# Altium project Project D.PrjPcb
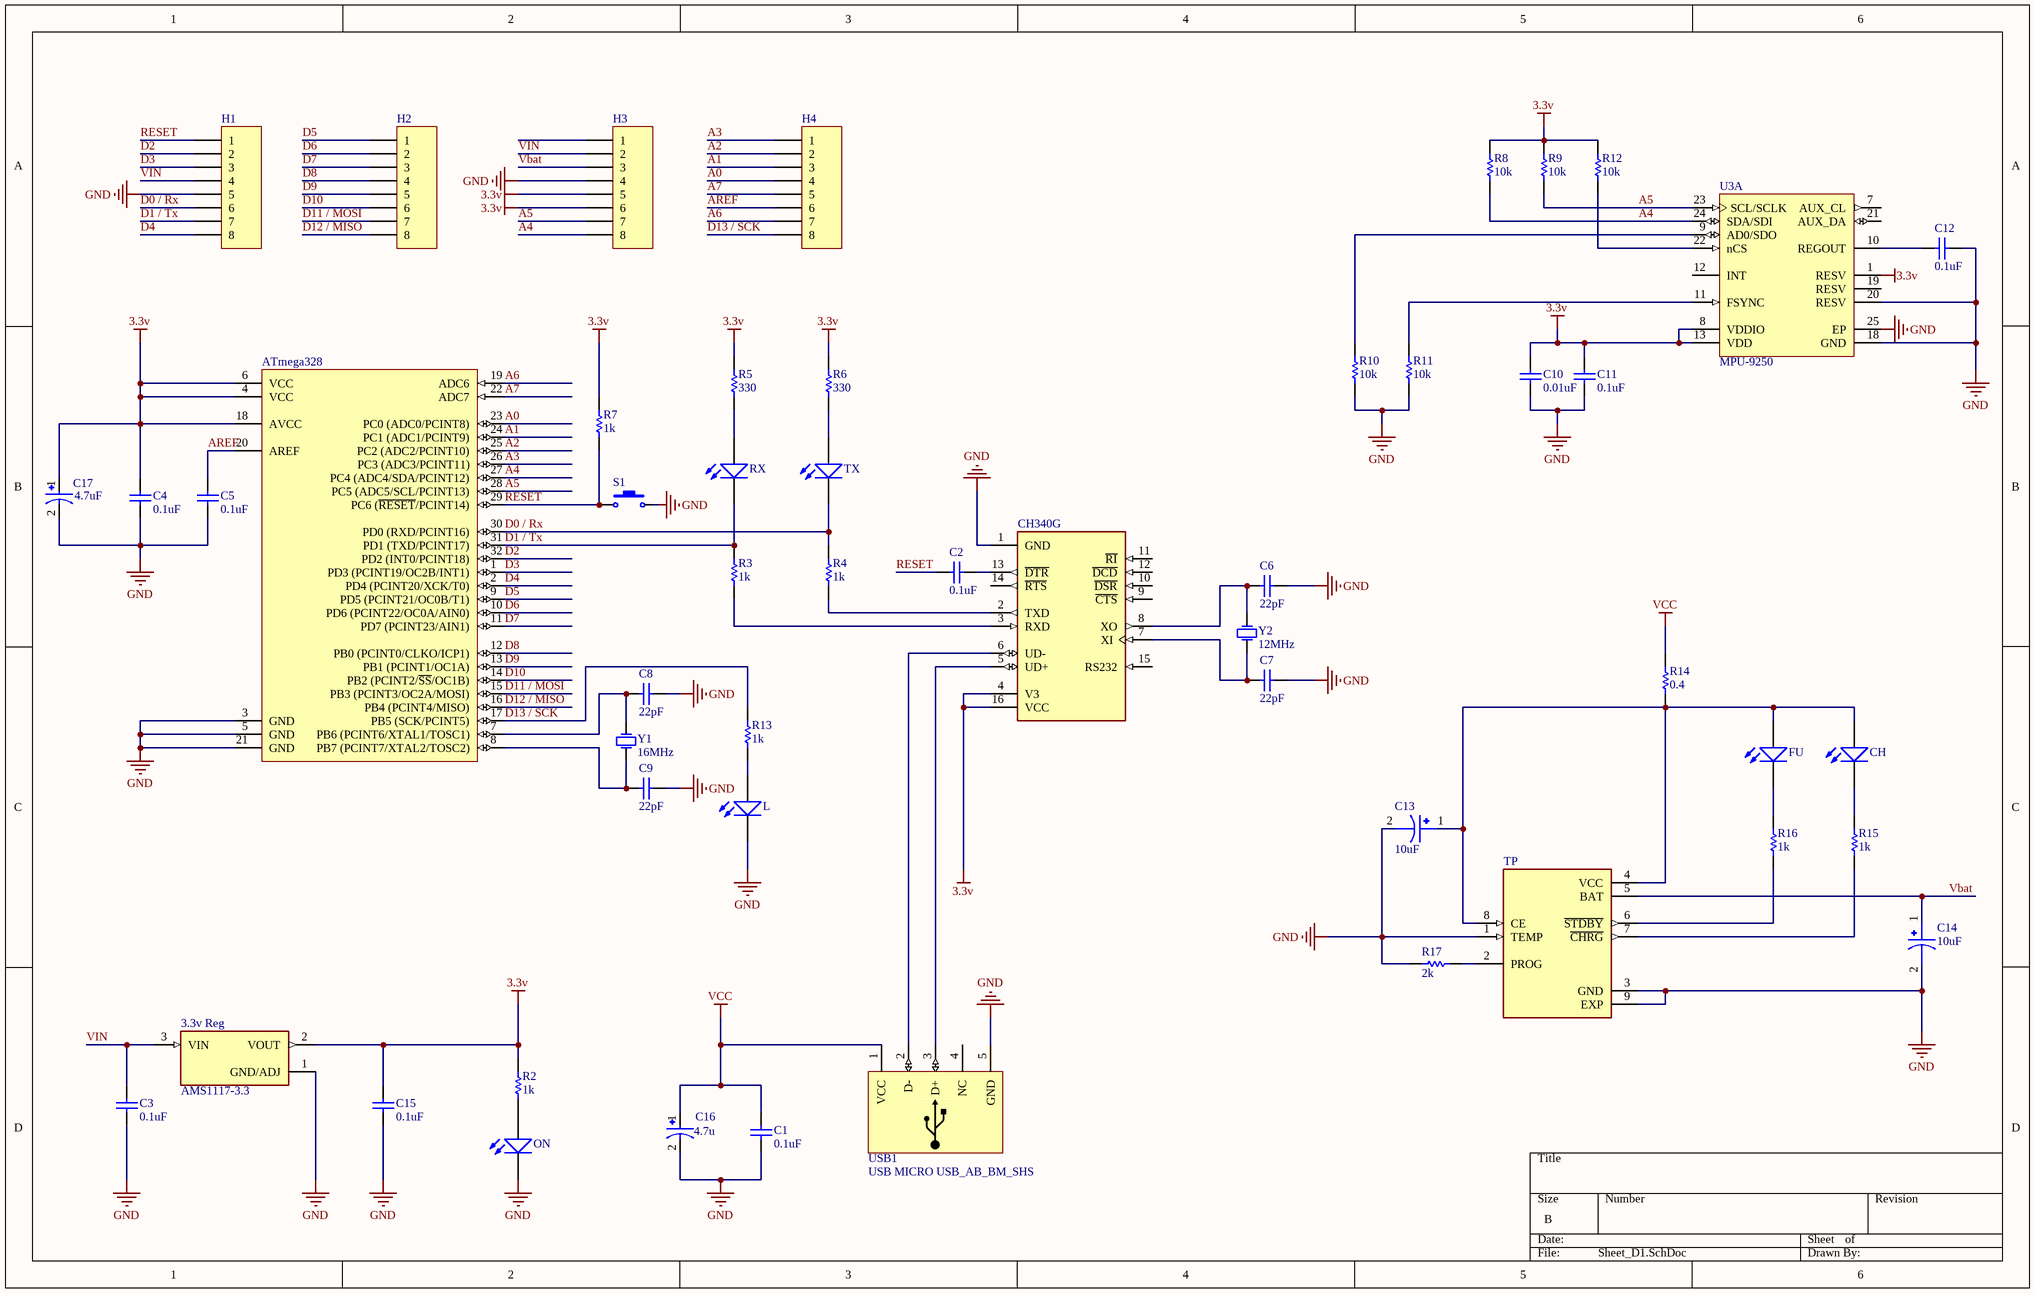
[diagram p0: Sheet_D1.SchDoc]
1 sheet, 52 parts. Net scope: global (net labels, ports and power ports of the same name join across sheets).
Board file: PCB_D1.PcbDoc

## Sheet Sheet_D1.SchDoc
size B; SheetNumber: 1; SheetTotal: 1

### Parts
3.3v_Reg  AMS1117-3.3  [SOT229P700X180-4N]
ATmega328  (no value)  [32A_L]
C1  0.1uF  [CAP0805]
C2  0.1uF  [CAP0805]
C3  0.1uF  [CAP0805]
C4  0.1uF  [CAP0805]
C5  0.1uF  [CAP0805]
C6  22pF  [CAP0805]
C7  22pF  [CAP0805]
C8  22pF  [CAP0805]
C9  22pF  [CAP0805]
C10  0.01uF  [CAP0805]
C11  0.1uF  [CAP0805]
C12  0.1uF  [CAP0805]
C13  10uF  [CAPMP3216X180N]
C14  10uF  [CAPMP3216X180N]
C15  0.1uF  [CAP0805]
C16  4.7u  [CAPMP3516X190N]
C17  4.7uF  [CAPMP3516X190N]
CH  (no value)  [LED_SMD_0805]
CH340G  (no value)  [SOIC127P600X180-16N]
FU  (no value)  [LED_SMD_0805]
H1  (no value)  [Header 8]
H2  (no value)  [Header 8]
H3  (no value)  [Header 8]
H4  (no value)  [Header 8]
L  (no value)  [LED_SMD_0805]
ON  (no value)  [LED_SMD_0805]
R2  1k  [RES0805]
R3  1k  [RES0805]
R4  1k  [RES0805]
R5  330  [RES0805]
R6  330  [RES0805]
R7  1k  [RES0805]
R8  10k  [RES0805]
R9  10k  [RES0805]
R10  10k  [RES0805]
R11  10k  [RES0805]
R12  10k  [RES0805]
R13  1k  [RES0805]
R14  0.4  [RES0805]
R15  1k  [RES0805]
R16  1k  [RES0805]
R17  2k  [RES0805]
RX  (no value)  [LED_SMD_0805]
S1  (no value)  [Push Button Switch SMD]
TP  (no value)  [SOIC127P600X175-9N]
TX  (no value)  [LED_SMD_0805]
U3  MPU-9250  [INSE-QFN-24-1700X1540TP_M]  (part A of 2)
USB1  USB MICRO USB_AB_BM_SHS  [USB MICRO USB_AB_BM_SHS]
Y1  16MHz  [Crystal SMD]
Y2  12MHz  [Crystal SMD]

### Nets
3.3v: 3.3v_Reg.2(VOUT) ATmega328.4(VCC) ATmega328.6(VCC) ATmega328.18(AVCC) C4.1 C10.2 C11.2 C15.2 C17.1 CH340G.4(V3) CH340G.16(VCC) H3.5 H3.6 R2.2 R5.2 R6.2 R7.2 R8.2 R9.2 R12.2 U3.1(RESV) U3.8(VDDIO) U3.13(VDD)
GND: 3.3v_Reg.1(GND/ADJ) ATmega328.3(GND) ATmega328.5(GND) ATmega328.21(GND) C1.1 C3.2 C4.2 C5.1 C6.1 C7.1 C8.1 C9.1 C10.1 C11.1 C12.2 C13.2 C14.2 C15.1 C16.2 C17.2 CH340G.1(GND) H1.5 H3.4 L.1(K) ON.1(K) R10.2 R11.1 R17.1 S1.2 TP.1(TEMP) TP.3(GND) TP.9(EXP) U3.18(GND) U3.20(RESV) U3.25(EP) USB1.5(GND)
VCC: C1.2 C16.1 R14.2 USB1.1(VCC)
A0: ATmega328.23(PC0_(ADC0/PCINT8)) H4.4
A1: ATmega328.24(PC1_(ADC1/PCINT9)) H4.3
A2: ATmega328.25(PC2_(ADC2/PCINT10)) H4.2
A3: ATmega328.26(PC3_(ADC3/PCINT11)) H4.1
A4: ATmega328.27(PC4_(ADC4/SDA/PCINT12)) H3.8 R8.1 U3.24(SDA/SDI)
A5: ATmega328.28(PC5_(ADC5/SCL/PCINT13)) H3.7 R9.1 U3.23(SCL/SCLK)
A6: ATmega328.19(ADC6) H4.7
A7: ATmega328.22(ADC7) H4.5
AREF: ATmega328.20(AREF) C5.2 H4.6
D0 / Rx: ATmega328.30(PD0_(RXD/PCINT16)) H1.6 R4.2 TX.1(K)
D1 / Tx: ATmega328.31(PD1_(TXD/PCINT17)) H1.7 R3.2 RX.1(K)
D2: ATmega328.32(PD2_(INT0/PCINT18)) H1.2
D3: ATmega328.1(PD3_(PCINT19/OC2B/INT1)) H1.3
D4: ATmega328.2(PD4_(PCINT20/XCK/T0)) H1.8
D5: ATmega328.9(PD5_(PCINT21/OC0B/T1)) H2.1
D6: ATmega328.10(PD6_(PCINT22/OC0A/AIN0)) H2.2
D7: ATmega328.11(PD7_(PCINT23/AIN1)) H2.3
D8: ATmega328.12(PB0_(PCINT0/CLKO/ICP1)) H2.4
D9: ATmega328.13(PB1_(PCINT1/OC1A)) H2.5
D10: ATmega328.14(PB2_(PCINT2/~{SS}/OC1B)) H2.6
D11 / MOSI: ATmega328.15(PB3_(PCINT3/OC2A/MOSI)) H2.7
D12 / MISO: ATmega328.16(PB4_(PCINT4/MISO)) H2.8
D13 / SCK: ATmega328.17(PB5_(SCK/PCINT5)) H4.8 R13.1
RESET: ATmega328.29(PC6_(~{RESET}/PCINT14)) C2.2 H1.1 R7.1 S1.1
Vbat: C14.1 H3.3 TP.5(BAT)
VIN: 3.3v_Reg.3(VIN) C3.1 H1.4 H3.2
NetATmega328_7: ATmega328.7(PB6_(PCINT6/XTAL1/TOSC1)) C8.2 Y1.2(OSC2)
NetATmega328_8: ATmega328.8(PB7_(PCINT7/XTAL2/TOSC2)) C9.2 Y1.1(OSC1)
NetC2_1: C2.1 CH340G.13(~{DTR})
NetC6_2: C6.2 CH340G.8(XO) Y2.2(OSC2)
NetC7_2: C7.2 CH340G.7(XI) Y2.1(OSC1)
NetC12_1: C12.1 U3.10(REGOUT)
NetC13_1: C13.1 CH.2(A) FU.2(A) R14.1 TP.4(VCC) TP.8(CE)
NetCH340G_2: CH340G.2(TXD) R4.1
NetCH340G_3: CH340G.3(RXD) R3.1
NetCH340G_5: CH340G.5(UD+) USB1.3(D+)
NetCH340G_6: CH340G.6(UD-) USB1.2(D-)
NetCH_1: CH.1(K) R15.1
NetFU_1: FU.1(K) R16.2
NetL_2: L.2(A) R13.2
NetON_2: ON.2(A) R2.1
NetR5_1: R5.1 RX.2(A)
NetR6_1: R6.1 TX.2(A)
NetR10_1: R10.1 U3.9(AD0/SDO)
NetR11_2: R11.2 U3.11(FSYNC)
NetR12_1: R12.1 U3.22(nCS)
NetR15_2: R15.2 TP.7(~{CHRG})
NetR16_1: R16.1 TP.6(~{STDBY})
NetR17_2: R17.2 TP.2(PROG)

Not connected (* = marked no-connect by the designer): CH340G 9(~{CTS}) 10(~{DSR}) 11(~{RI}) 12(~{DCD}) 14(~{RTS}) 15(RS232); H3 1; U3 7(AUX_CL) 12(INT) 19(RESV) 21(AUX_DA); USB1 4(NC)

### Library data of the parts
3.3v_Reg = AMS1117-3.3: Sot223/Pkg 1-Amp 3.3-Volt Low Drop Out Voltage Regulatator; MF: Advanced Monolithic Systems; Package: SOT-223 Seeed Technology; Value: *; Check_prices: https://www.snapeda.com/parts/AMS1117-3.3/Advanced+Monolithic+Systems/view-part/?ref=eda; Price: None; Availability: Not in stock; MP: AMS1117-3.3; SnapEDA_Link: https://www.snapeda.com/parts/AMS1117-3.3/Advanced+Monolithic+Systems/view-part/?ref=snap
ATmega328 = CMP-0095-00261-2: 8-bit AVR Microcontroller, 32KB Flash, 1KB EEPROM, 2KB SRAM, 32-pin TQFP, Industrial Grade (-40°C to 85°C); DatasheetVersion: revD, May-2011; ComponentLink3Description: ATmega48A/48PA/88A/88PA/168A/168PA/328/328P Summary; Code_JEDEC: MS-026-ABA; ComponentLink1URL: http://www.atmel.com/; RevisionNote: DatasheetVersion & PackageVersion updated. URLs added.; ComponentLink2Description: ATmega48A/48PA/88A/88PA/168A/168PA/328/328P Datasheet; ComponentLink1Description: Manufacturer URL; ComponentLink2URL: http://www.atmel.com/dyn/resources/prod_documents/doc8271.pdf; PackageReference: 32A; ComponentLink3URL: http://www.atmel.com/dyn/resources/prod_documents/8271S.pdf; PackageDescription: 32-Lead, 7x7x1.0 mm Body, 0.8mm Lead Pitch, Thin Profile Plastic Quad Flat Package (TQFP); PackageVersion: revC, Oct-2010
C1-C12 C15 = CAP0805
C13 C14 = TAJA106K016RNJ: MF: AVX; MP: TAJA106K016RNJ; Price: None; Availability: Warning; SnapEDA_Link: https://www.snapeda.com/parts/TAJA106K016RNJ/AVX%20/%20Kyocera/view-part/47127/?ref=snap; Arrow_Electronics-Purchase-URL: https://snapeda.com/shop?store=Arrow+Electronics&id=47127; Value: *; Mouser-Purchase-URL: https://snapeda.com/shop?store=Mouser&id=47127; Package: 1206 AVX
C16 C17 = TAJB475K025RNJ: 4.7 ÂµF Molded Tantalum Capacitors 25 V 1411 (3528 Metric), 1210 1.5Ohm; MF: AVX; Package: 1411 AVX Corporation; Availability: In Stock; Value: *; MP: TAJB475K025RNJ; Purchase-URL: https://pricing.snapeda.com/search/part/TAJB475K025RNJ/?ref=eda; Check_prices: https://www.snapeda.com/parts/TAJB475K025RNJ/AVX/view-part/?ref=eda; Price: None; SnapEDA_Link: https://www.snapeda.com/parts/TAJB475K025RNJ/AVX/view-part/?ref=snap
CH FU L ON RX TX = LED_SMD_0805
CH340G = CH340G: USB Interface Integrated Circuit; MF: WCH; Value: *; SnapEDA_Link: https://www.snapeda.com/parts/Ch340G/WCH/view-part/?ref=snap; MP: Ch340G; Check_prices: https://www.snapeda.com/parts/Ch340G/WCH/view-part/?ref=eda; Availability: Not in stock; Price: None; Package: None
H1-H4 = Header 8
R2-R17 = RES0805
S1 = Push Button Switch SMD
TP = TP4056-42-ESOP8: TP4056-42-ESOP8 TP; MF: Lite-On Semiconductor; SnapEDA_Link: https://www.snapeda.com/parts/TP4056-42-ESOP8/Lite-On/view-part/?ref=snap; Package: None; Value: *; MP: TP4056-42-ESOP8; Check_prices: https://www.snapeda.com/parts/TP4056-42-ESOP8/Lite-On/view-part/?ref=eda
U3 = CMP-2100-03657-1: 9-axis MotionTracking device, 2.4 to 3,6 V, -40 to 85 degC, 24-Pin QFN, RoHS, Tape and Reel; Manufacturer: InvenSense; Max Supply Voltage: 3.6V; Min Supply Voltage: 2.4V; Package Reference: QFN-24; Package Quantity: 1; Datasheet Version: Rev. 1.0, 01/2014; Case/Package: QFN; Package Description: 24-Pin Quad Flat No-lead Package, Body 3 x 3 mm, Pitch 0.4 mm; Datasheet URL: http://datasheet.octopart.com/MPU-9250-InvenSense-datasheet-21859386.pdf; RoHSCompliant: true; Max Operating Temperature: 85degC; Height: 1mm; Mount: SurfaceMount; Manufacturer URL: http://www.invensense.com/; Width: 3.1mm; Min Operating Temperature: -40degC; Length: 3.1mm
Y1 Y2 = Crystal SMD